# EAGLE design Grove - Protoshield v1.0 (EAGLE 5.10)
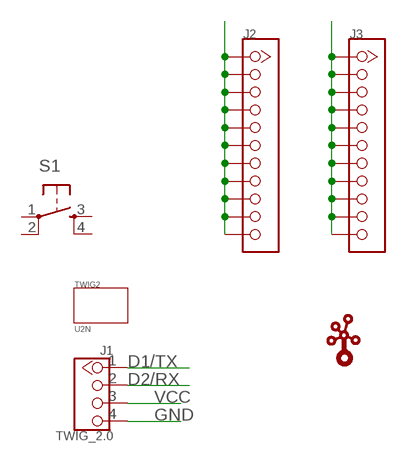
[diagram p0: schematic, sheet 1]

## Parts
J1  TWIG_2.0  [2.0_1X4]
J2  CK_1X11  [CK_1X11]
J3  CK_1X11  [CK_1X11]
S1  TAC_SWITCHPTH  [TACTILE-PTH]
TWIG2  U2N  [U2N]
U$1  TWIGLOGOTWIGLOGO_SMALL  [TWIGLOGO_SMALL]

## Nets
D1/TX: J1.1
D2/RX: J1.2
GND: J1.4 J3.1 J3.2 J3.3 J3.4 J3.5 J3.6 J3.7 J3.8 J3.9 J3.10 J3.11
VCC: J1.3 J2.1 J2.2 J2.3 J2.4 J2.5 J2.6 J2.7 J2.8 J2.9 J2.10 J2.11
Unconnected: S1.1 S1.2 S1.3 S1.4

## Library data of the parts
J1 = CONNECTER:TWIG_2.0
J2 J3 = CONNECTER:CK_1X11
S1 = SparkFun:TAC_SWITCH: Momentary Switch Button commonly used for reset or general input. Spark Fun Electronics SKU : COM-00097
TWIG2 = twig_template1:U2N
U$1 = seeedleo:TWIGLOGO

## Board
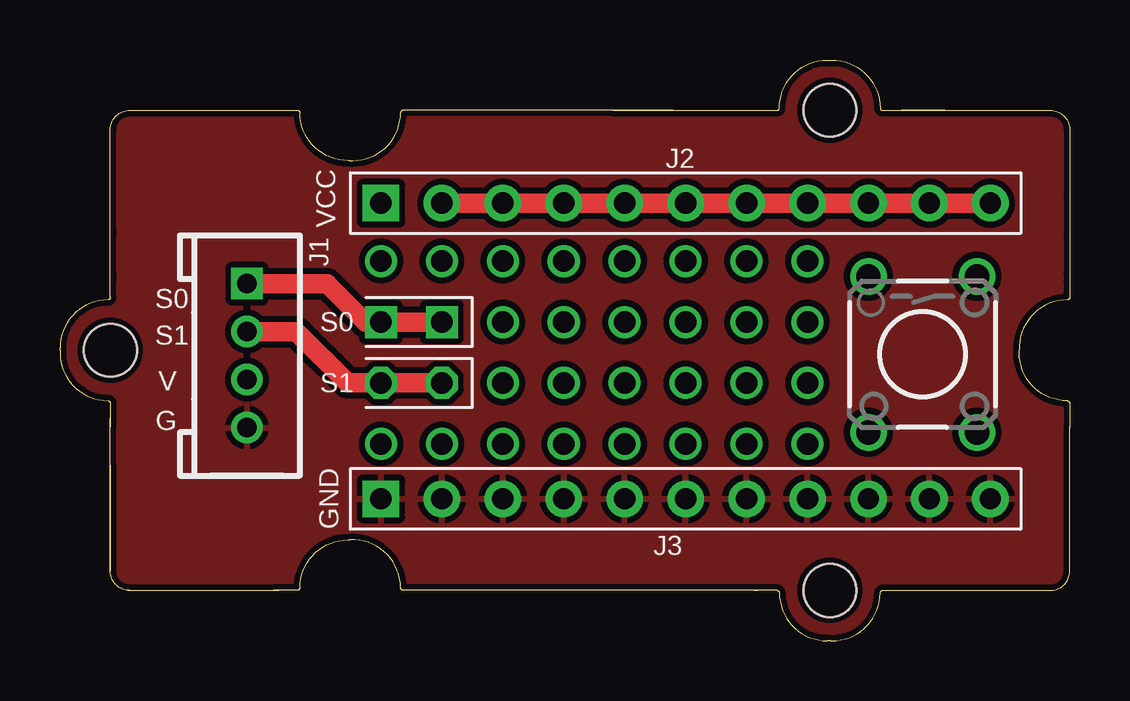
[diagram p1: board, top side]
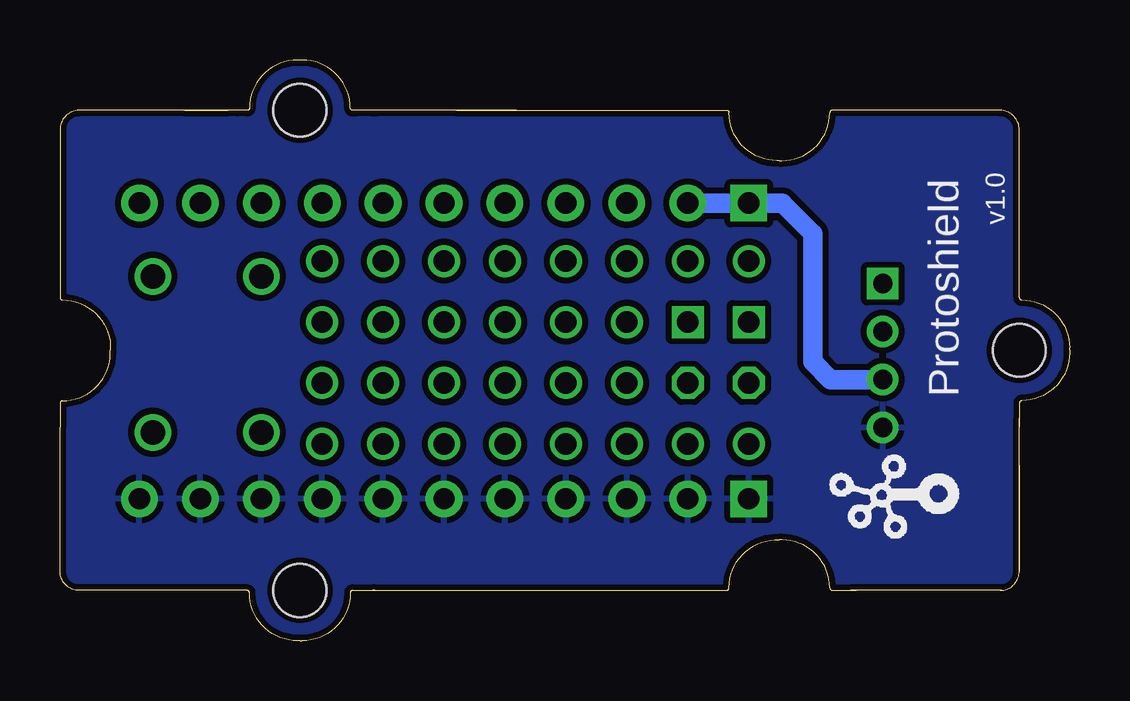
[diagram p2: board, bottom side, seen from below]

Size 42.09 x 24.2 mm. Coordinates in mm from the lower left corner, seen from the top.
Copper layers (1*16): Top 0.035mm / dielectric 1.5mm / Bottom 0.035mm
Design rules "SeeedStudio_rule_no_angle_090911": minimum track width 6mil, minimum drill 12mil, track to track 6mil, track to pad 6mil, pad to pad 6mil, via to via 6mil, smd to smd 0mil, copper to edge 10mil, drill to drill 10mil, minimum pad ring 10mil, minimum via ring 6mil, stop-mask expansion 2mil, vias tented up to drill 100mil, thermal gap 10mil

### Footprints (pad centres in the part's own frame; a part is rotated, then mirrored left to right if it is on the bottom)
2.0_1X4 = drill 0.8 pad 1.27 square: 1 -3,0 | drill 0.8 pad 1.27 round: 2 -1,0; 3 1,0; 4 3,0
CK_1X11 = drill 0.889 pad 1.524 square: 1 0,12.7 | drill 0.889 pad 1.524 round: 2 0,10.16; 3 0,7.62; 4 0,5.08; 5 0,2.54; 6 0,0; 7 0,-2.54; 8 0,-5.08; 9 0,-7.62; 10 0,-10.16; 11 0,-12.7
TACTILE-PTH = drill 1.016 round: 1 -3.251,2.261; 2 3.251,2.261; 3 -3.251,-2.261; 4 3.251,-2.261
U2N = hole 2.2: 10.453,-10.42; 10.453,9.58; -19.535,-0.415

### Placement (x,y rotation side)
J1  7.79,11.88 270 top
J2  26.08,18.23 90 top
J3  26.08,5.92 90 top
S1  35.96,11.94 270 top
TWIG2  21.64,12.52 0 top
U$1  4.49,3.88 90 bottom

### Tracks (layer width: path | path; a pad name or v marks a point on that pad's centre or on a via)
D1/TX  (via drill 0.89)
  Top 0.813: v13.38,13.28 13.38,13.41 | J1.1 11.14,14.88 12.75,13.28 v13.38,13.28 | v13.38,13.28 v15.92,13.28
D2/RX  (via drill 0.89)
  Top 0.813: v13.38,10.74 13.38,10.87 | v13.38,10.74 v15.92,10.74 | J1.2 9.84,12.88 11.98,10.74 v13.38,10.74
GND
  pour Top (isolate 0.254): -0.21,24.2 42.34,24.2 42.34,-0.18 -0.21,-0.18
  pour Bottom (isolate 0.254): -0.21,24.2 42.34,24.2 42.34,-0.18 -0.21,-0.18
N$4  (via drill 0.89)
  other vias: 31.16,13.28
N$5  (via drill 0.89)
  other vias: 31.16,15.82
N$27  (via drill 0.89)
  other vias: 21,8.2
N$53  (via drill 0.89)
  other vias: 13.38,15.82
N$55  (via drill 0.89)
  other vias: 15.92,15.82
N$57  (via drill 0.89)
  other vias: 18.46,15.82
N$59  (via drill 0.89)
  other vias: 31.16,10.74
N$63  (via drill 0.89)
  other vias: 26.08,15.82
N$69  (via drill 0.89)
  other vias: 18.46,13.28
N$70  (via drill 0.89)
  other vias: 18.46,10.74
N$71  (via drill 0.89)
  other vias: 21,10.74
N$72  (via drill 0.89)
  other vias: 21,13.28
N$73  (via drill 0.89)
  other vias: 23.54,10.74
N$74  (via drill 0.89)
  other vias: 23.54,13.28
N$76  (via drill 0.89)
  other vias: 13.38,8.2
N$78  (via drill 0.89)
  other vias: 15.92,8.2
N$79  (via drill 0.89)
  other vias: 18.46,8.2
N$80  (via drill 0.89)
  other vias: 21,15.82
N$83  (via drill 0.89)
  other vias: 23.54,15.82
N$85  (via drill 0.89)
  other vias: 26.08,13.28
N$86  (via drill 0.89)
  other vias: 26.08,10.74
N$87  (via drill 0.89)
  other vias: 26.08,8.2
N$89  (via drill 0.89)
  other vias: 23.54,8.2
N$90  (via drill 0.89)
  other vias: 28.62,15.82
N$91  (via drill 0.89)
  other vias: 28.62,13.28
N$92  (via drill 0.89)
  other vias: 28.62,10.74
N$93  (via drill 0.89)
  other vias: 28.62,8.2
N$94  (via drill 0.89)
  other vias: 31.16,8.2
VCC
  Top 0.813: J2.2 J2.3 J2.4 21.51,18.23 22.78,18.23 J2.5 J2.6 J2.7 J2.8 J2.9 J2.10 J2.11
  Bottom 0.813: J2.2 J2.1 11.98,18.23 10.71,16.96 10.71,11.63 9.97,10.88 J1.3

### Text on the board
tPlace: VCC | S0 | S1 | S0 | V | S1 | G | GND
bPlace: Protoshield | v1.0